# EAGLE schematic MCU_Module V2 (EAGLE 7.6.0)
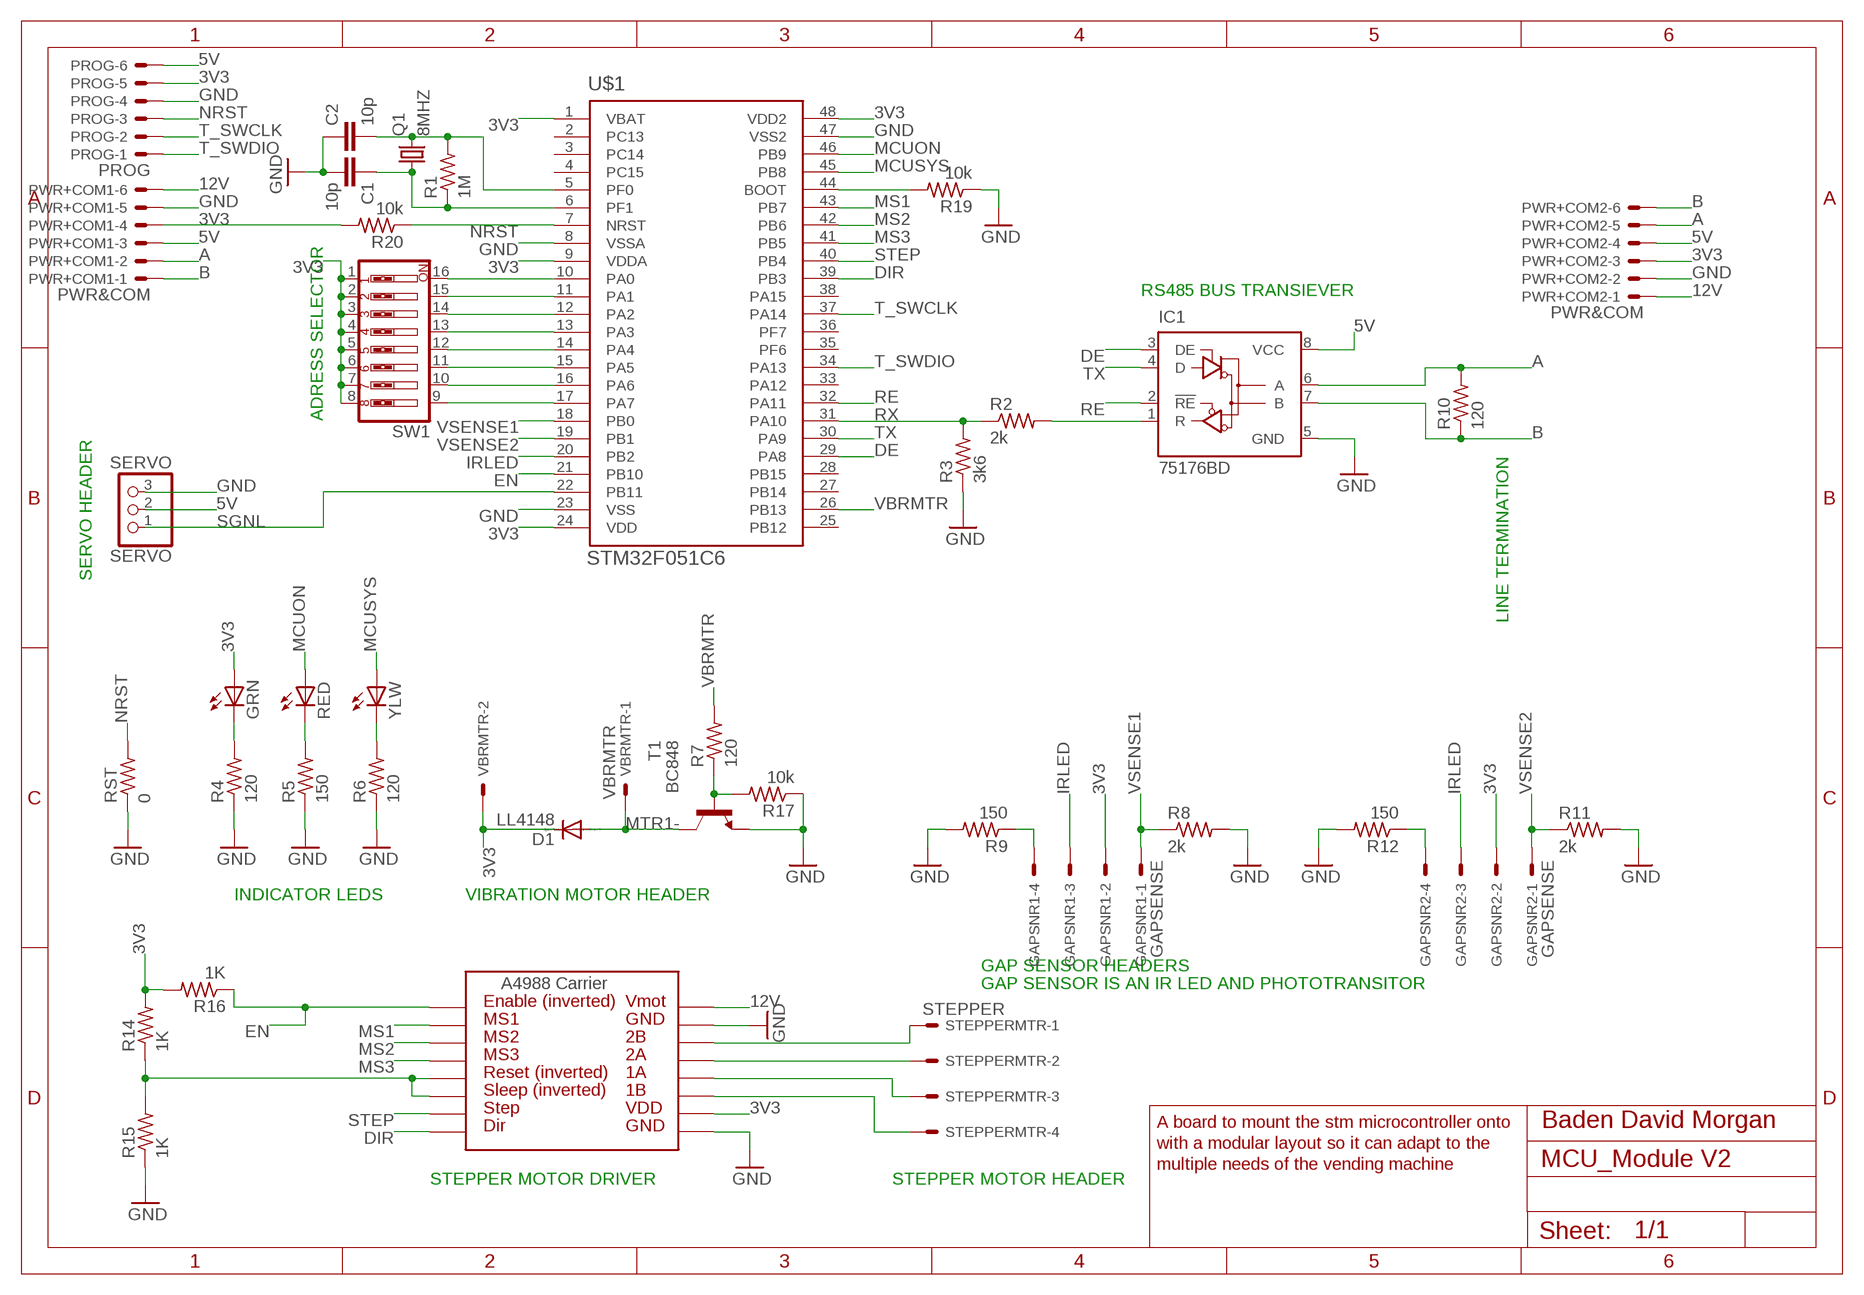
[diagram p0: schematic, sheet 1]

## Parts
C1  10p  C-EUC0805  [C0805]
C2  10p  C-EUC0805  [C0805]
D1  LL4148  PMLL4150  [SOD80C]
GAPSNR1  GAPSENSE  22-27-2041-04  [6410-04]
GAPSNR2  GAPSENSE  22-27-2041-04  [6410-04]
GRN  LEDSML1206  [SML1206]
IC1  75176BD  75176AD  [D_R-PDSO-G8]
PROG  PROG  22-27-2061-06  [6410-06]
PWR+COM1  PWR&COM  22-05-7068-06  [7395-06]
PWR+COM2  PWR&COM  22-05-7068-06  [7395-06]
Q1  8MHZ  CRYSTALSM49  [SM49]
R1  1M  R-US_R0805  [R0805]
R2  2k  R-US_R0805  [R0805]
R3  3k6  R-US_R0805  [R0805]
R4  120  R-US_R0805  [R0805]
R5  150  R-US_R0805  [R0805]
R6  120  R-US_R0805  [R0805]
R7  120  R-US_R0805  [R0805]
R8  2k  R-US_R0805  [R0805]
R9  150  R-US_R0805  [R0805]
R10  120  R-US_R0805  [R0805]
R11  2k  R-US_R0805  [R0805]
R12  150  R-US_R0805  [R0805]
R14  1K  R-US_R0805  [R0805]
R15  1K  R-US_R0805  [R0805]
R16  1K  R-US_R0805  [R0805]
R17  10k  R-US_R0805  [R0805]
R19  10k  R-US_R0805  [R0805]
R20  10k  R-US_R0805  [R0805]
RED  LEDSML1206  [SML1206]
RST  0  R-US_R0805  [R0805]
SERVO  SERVO  PINHD-1X3  [1X03]
STEPPERMTR  STEPPER  22-27-2041-04  [6410-04]
SW1  SW_DIP-8  [EDG-08]
T1  BC848  [SOT23]
U$1  STM32F051C6  [QFP50P900X900X160-48N]
U$2  A4983CARRIER  [A4988BREAKOUT]
VBRMTR  VBRMTR  22-27-2021-02  [6410-02]
YLW  LEDSML1206  [SML1206]

## Nets
3V3: D1.C GAPSNR1.2 GAPSNR2.2 GRN.A PROG.5 PWR+COM1.4 PWR+COM2.3 R14.2 R16.2 R20.2 SW1.1 SW1.2 SW1.3 SW1.4 SW1.5 SW1.6 SW1.7 SW1.8 U$1.1(VBAT) U$1.9(VDDA) U$1.24(VDD) U$1.48(VDD2) U$2.VDD VBRMTR.2
5V: IC1.8(VCC) PROG.6 PWR+COM1.3 PWR+COM2.4 SERVO.2
12V: PWR+COM1.6 PWR+COM2.1 U$2.VMOT
A: IC1.6(A) PWR+COM1.2 PWR+COM2.5 R10.2
B: IC1.7(B) PWR+COM1.1 PWR+COM2.6 R10.1
DE: IC1.3(DE) U$1.29(PA8)
DIR: U$1.39(PB3) U$2.DIR
EN: R16.1 U$1.21(PB10) U$2.EN
GND: C1.2 C2.1 IC1.5(GND) PROG.4 PWR+COM1.5 PWR+COM2.2 R3.1 R4.1 R5.1 R6.1 R8.2 R9.2 R11.2 R12.2 R15.1 R17.1 R19.1 RST.1 SERVO.3 T1.2(E) U$1.8(VSSA) U$1.23(VSS) U$1.47(VSS2) U$2.GND U$2.GND@0(GND)
IRLED: GAPSNR1.3 GAPSNR2.3 U$1.20(PB2)
MCUON: RED.A U$1.46(PB9)
MCUSYS: U$1.45(PB8) YLW.A
MS1: U$1.43(PB7) U$2.MS1
MS2: U$1.42(PB6) U$2.MS2
MS3: U$1.41(PB5) U$2.MS3
MTR1-: D1.A T1.3(C) VBRMTR.1
N$1: C1.1 Q1.1 R1.1 U$1.6(PF1)
N$2: C2.2 Q1.2 R1.2 U$1.5(PF0)
N$3: SW1.16 U$1.10(PA0)
N$5: STEPPERMTR.4 U$2.1B
N$6: SW1.15 U$1.11(PA1)
N$7: SW1.14 U$1.12(PA2)
N$8: SW1.13 U$1.13(PA3)
N$9: IC1.1(R) R2.2
N$10: SW1.12 U$1.14(PA4)
N$11: SW1.11 U$1.15(PA5)
N$12: SW1.10 U$1.16(PA6)
N$13: SW1.9 U$1.17(PA7)
N$14: GRN.C R4.2
N$15: R5.2 RED.C
N$16: R6.2 YLW.C
N$17: R7.1 R17.2 T1.1(B)
N$18: STEPPERMTR.3 U$2.1A
N$19: GAPSNR1.4 R9.1
N$20: STEPPERMTR.2 U$2.2A
N$21: STEPPERMTR.1 U$2.2B
N$22: R19.2 U$1.44(BOOT)
N$24: GAPSNR2.4 R12.1
N$26: R14.1 R15.2 U$2.RST U$2.SLP(SLEEP)
NRST: PROG.3 R20.1 RST.2 U$1.7(NRST)
RE: IC1.2(!RE) U$1.32(PA11)
RX: R2.1 R3.2 U$1.31(PA10)
SGNL: SERVO.1 U$1.22(PB11)
STEP: U$1.40(PB4) U$2.STEP
T_SWCLK: PROG.2 U$1.37(PA14)
T_SWDIO: PROG.1 U$1.34(PA13)
TX: IC1.4(D) U$1.30(PA9)
VBRMTR: R7.2 U$1.26(PB13)
VSENSE1: GAPSNR1.1 R8.1 U$1.18(PB0)
VSENSE2: GAPSNR2.1 R11.1 U$1.19(PB1)
Unconnected: U$1.2(PC13) U$1.3(PC14) U$1.4(PC15) U$1.25(PB12) U$1.27(PB14) U$1.28(PB15) U$1.33(PA12) U$1.35(PF6) U$1.36(PF7) U$1.38(PA15)

## Notes on the sheet
- RS485 BUS TRANSIEVER
- ADRESS SELECTOR
- LINE TERMINATION
- SERVO HEADER
- INDICATOR LEDS | VIBRATION MOTOR HEADER
- GAP SENSOR HEADERS
- GAP SENSOR IS AN IR LED AND PHOTOTRANSITOR
- A board to mount the stm microcontroller onto | Baden David Morgan
- with a modular layout so it can adapt to the
- multiple needs of the vending machine
- STEPPER MOTOR DRIVER | STEPPER MOTOR HEADER

## Library data of the parts
C1 C2 = rcl:C-EU: CAPACITOR, European symbol
D1 = diode:PMLL4150: DIODE high speed
GAPSNR1 GAPSNR2 STEPPERMTR = con-molex:22-?-04: CONNECTOR wire to board 2.54 mm (.1 inch) pitch header; OC_FARNELL: unknown; OC_NEWARK: unknown
GRN RED YLW = led:LED: LED OSRAM: - CHIPLED LG R971, LG N971, LY N971, LG Q971, LY Q971, LO R971, LY R971 LH N974, LH R974 LS Q976, LO Q976, LY Q976 LO Q996 - Hyper CHIPLED LW Q18S LB Q993, LB Q99A, LB R99A - SideLED LS A670, LO A670, LY A670, LG A670, LP A670 LB A673, LV A673, LT A673, LW A673 LH A674 LY A675 LS A676, LA A676, LO A676, LY A676, LW A676 LS A679, LY A679, LG A679 - Hyper Micro SIDELED® LS Y876, LA Y876, LO Y876, LY Y876 LT Y87S - SmartLED LW L88C, LW L88S LB L89C, LB L89S, LG L890 LS L89K, LO L89K, LY L89K LS L896, LA L896, LO L896, LY L896 - TOPLED LS T670, LO T670, LY T670, LG T670, LP T670 LSG T670, LSP T670, LSY T670, LOP T670, LYG T670 LG T671, LOG T671, LSG T671 LB T673, LV T673, LT T673, LW T673 LH T674 LS T676, LA T676, LO T676, LY T676, LB T676, LH T676, LSB T676, LW T676 LB T67C, LV T67C, LT T67C, LS T67K, LO T67K, LY T67K, LW E67C LS E67B, LA E67B, LO E67B, LY E67B, LB E67C, LV E67C, LT E67C LW T67C LS T679, LY T679, LG T679 LS T770, LO T770, LY T770, LG T770, LP T770 LB T773, LV T773, LT T773, LW T773 LH T774 LS E675, LA E675, LY E675, LS T675 LS T776, LA T776, LO T776, LY T776, LB T776 LHGB T686 LT T68C, LB T68C - Hyper Mini TOPLED® LB M676 - Mini TOPLED Santana® LG M470 LS M47K, LO M47K, LY M47K Source: http://www.osram.convergy.de LUXEON: - LUMILED® LXK2-PW12-R00, LXK2-PW12-S00, LXK2-PW14-U00, LXK2-PW14-V00 LXK2-PM12-R00, LXK2-PM12-S00, LXK2-PM14-U00 LXK2-PE12-Q00, LXK2-PE12-R00, LXK2-PE12-S00, LXK2-PE14-T00, LXK2-PE14-U00 LXK2-PB12-K00, LXK2-PB12-L00, LXK2-PB12-M00, LXK2-PB14-N00, LXK2-PB14-P00, LXK2-PB14-Q00 LXK2-PR12-L00, LXK2-PR12-M00, LXK2-PR14-Q00, LXK2-PR14-R00 LXK2-PD12-Q00, LXK2-PD12-R00, LXK2-PD12-S00 LXK2-PH12-R00, LXK2-PH12-S00 LXK2-PL12-P00, LXK2-PL12-Q00, LXK2-PL12-R00 Source: www.luxeon.com KINGBRIGHT: KA-3528ASYC Source: www.kingbright.com
IC1 = 751xx:75176A: DIFFERENTIAL BUS TRANSCEIVER Source: http://focus.ti.com/lit/ds/symlink/sn75176a.pdf
PROG PWR+COM1 PWR+COM2 = con-molex:22-?-06: CONNECTOR wire to board 2.54 mm (.1 inch) pitch header; OC_FARNELL: unknown; OC_NEWARK: unknown
Q1 = crystal:CRYSTAL: CRYSTAL; OC_FARNELL: unknown; OC_NEWARK: unknown
R1 R4-R7 R9 R12 R14-R17 R19 R20 RST = rcl:R-US_: RESISTOR, American symbol
R2 R3 R8 R10 R11 = resistor:R-US_: RESISTOR, American symbol
SERVO = pinhead:PINHD-1X3: PIN HEADER
SW1 = special:SW_DIP-8: DIP SWITCH
T1 = transistor:BC848: NPN TRANSISTOR
U$1 = STM32F0:STM32F051C6
U$2 = RepRapjr:A4983CARRIER
VBRMTR = con-molex:22-?-02: CONNECTOR wire to board 2.54 mm (.1 inch) pitch header; OC_FARNELL: unknown; OC_NEWARK: unknown